# Altium schematic sheet Charger.SchDoc
size A3
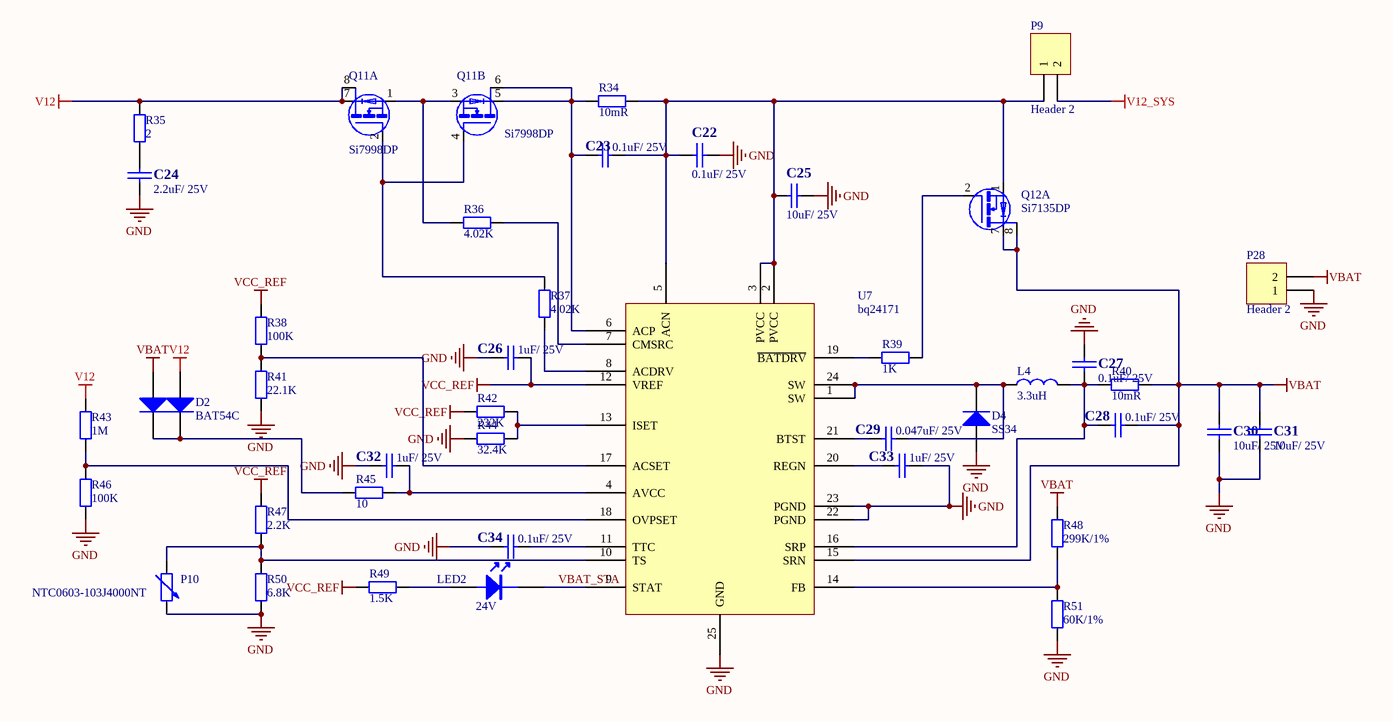
[diagram p0: Charger.SchDoc]

## Parts
C22  0.1uF/ 25V  [0603C]
C23  0.1uF/ 25V  [0603C]
C24  2.2uF/ 25V  [0603C]
C25  10uF/ 25V  [0603C]
C26  1uF/ 25V  [0603C]
C27  0.1uF/ 25V  [0603C]
C28  0.1uF/ 25V  [0603C]
C29  0.047uF/ 25V  [0603C]
C30  10uF/ 25V  [0603C]
C31  10uF/ 25V  [0603C]
C32  1uF/ 25V  [0603C]
C33  1uF/ 25V  [0603C]
C34  0.1uF/ 25V  [0603C]
D2  BAT54C  [SOT23-3]
D4  SS34  [SMA]
L4  3.3uH  [CDRH-127]
LED2  24V  [0603LED]
P9  Header 2  [HDR1X2]
P10  NTC0603-103J4000NT  [SMD-0603]
P28  Header 2  [HDR1X2]
Q11  Si7998DP  [PowerPAK SO-8]  (parts A,B of 2)
Q12  Si7135DP  [PowerPAK SO-8]  (part A of 2)
R34  10mR  [2512R]
R35  2  [SMD-0603]
R36  4.02K  [SMD-0603]
R37  4.02K  [SMD-0603]
R38  100K  [SMD-0603]
R39  1K  [2512R]
R40  10mR  [2512R]
R41  22.1K  [SMD-0603]
R42  232K  [SMD-0603]
R43  1M  [SMD-0603]
R44  32.4K  [SMD-0603]
R45  10  [SMD-0603]
R46  100K  [SMD-0603]
R47  2.2K  [SMD-0603]
R48  299K/1%  [SMD-0603]
R49  1.5K  [SMD-0603]
R50  6.8K  [SMD-0603]
R51  60K/1%  [SMD-0603]
U7  bq24171  [bq24171]

## Nets
GND: C22.2 C24.2 C25.2 C26.2 C27.1 C30.2 C31.2 C32.2 C33.1 C34.2 D4.1(A) P10.2 P28.1 R41.1 R44.1 R46.1 R50.1 R51.2 U7.22(PGND) U7.23(PGND) U7.25(GND)
V12: D2.1(A) Q11.7(D1) Q11.8(D1) R35.2 R43.2
V12_SYS: P9.2
VBAT: C28.1 C30.1 C31.1 D2.2(A) P28.2 Q12.7(D1) Q12.8(D1) R40.2 R48.1 U7.15(SRN)
VCC_REF: C26.1 R38.2 R42.1 R47.2 R49.1 U7.12(VREF)
VBAT_STA: LED2.2 U7.9(STAT)
NetC22_1: C22.1 C23.2 C25.1 P9.1 Q12.1(S1) R34.2 U7.2(PVCC) U7.3(PVCC) U7.5(ACN)
NetC23_1: C23.1 Q11.5(D2) Q11.6(D2) R34.1 U7.6(ACP)
NetC24_1: C24.1 R35.1
NetC27_2: C27.2 C28.2 L4.2 R40.1 U7.16(SRP)
NetC29_1: C29.1 D4.2(K) L4.1 U7.1(SW) U7.24(SW)
NetC29_2: C29.2 U7.21(BTST)
NetC32_1: C32.1 R45.2 U7.4(AVCC)
NetC33_2: C33.2 U7.20(REGN)
NetC34_1: C34.1 U7.11(TTC)
NetD2_3: D2.3(K) R45.1
NetLED2_1: LED2.1 R49.2
NetP10_1: P10.1 R47.1 R50.2 U7.10(TS)
NetQ11_1: Q11.1(S1) Q11.3(S2) R36.1
NetQ11_2: Q11.2(G1) Q11.4(G2) R37.2
NetQ12_2: Q12.2(G1) R39.2
NetR36_2: R36.2 U7.7(CMSRC)
NetR37_1: R37.1 U7.8(ACDRV)
NetR38_1: R38.1 R41.2 U7.17(ACSET)
NetR39_1: R39.1 U7.19(~{BATDRV})
NetR42_2: R42.2 R44.2 U7.13(ISET)
NetR43_1: R43.1 R46.2 U7.18(OVPSET)
NetR48_2: R48.2 R51.1 U7.14(FB)

## Library data of the parts
C22-C34 = CAP: Capacitor
D4 = DIODE
L4 = IND
LED2 = LED
P9 P28 = Header 2: Header, 2-Pin; LatestRevisionDate: 17-Jul-2002; LatestRevisionNote: Re-released for DXP Platform.; Publisher: Altium Limited
P10 = RES3: 卧贴
Q11 Q12 = SI7940DP
R34-R51 = RES2: 贴片电阻 5%